# EAGLE design waterius-homemade (EAGLE 9.0.1)
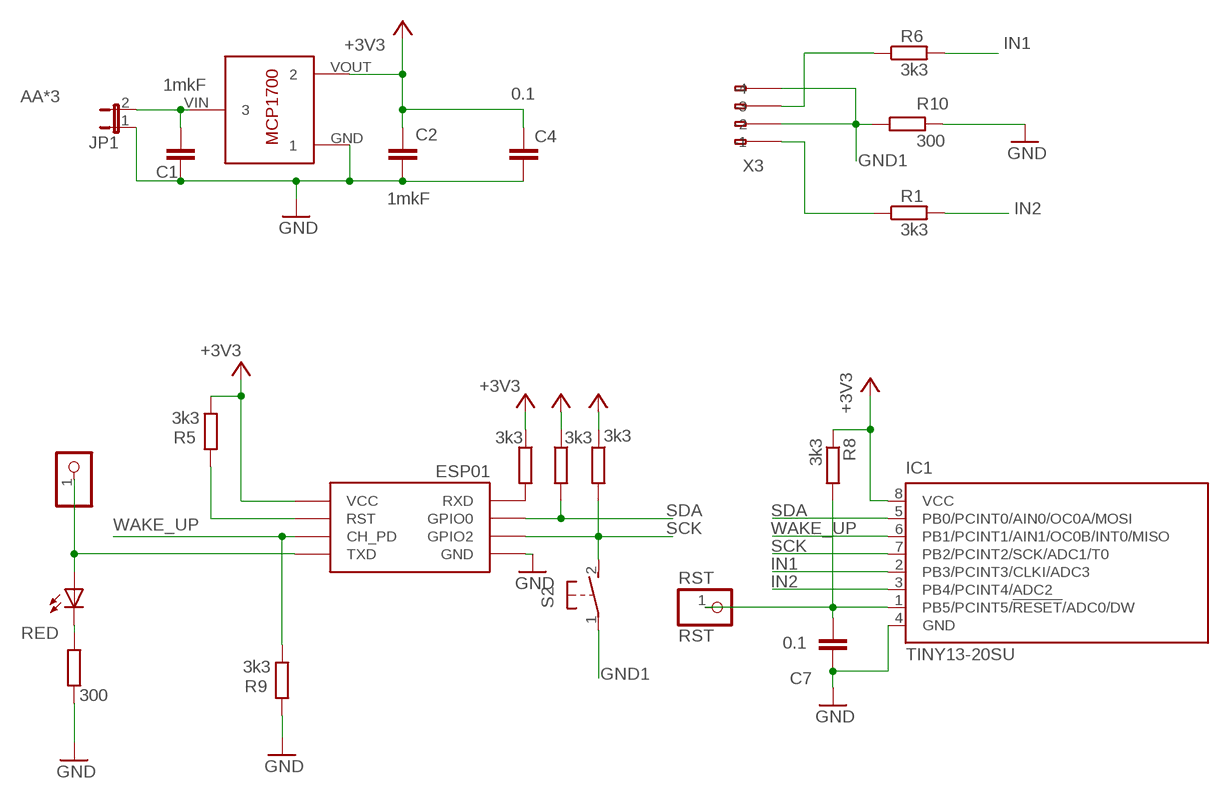
[diagram p0: schematic, sheet 1]

## Parts
C1  1mkF  C-EUC0805  [C0805]
C2  1mkF  C-EUC0805  [C0805]
C4  0.1  C-EUC0805  [C0805]
C7  0.1  C-EUC0805  [C0805]
IC1  TINY13-20SU  [8S2]
JP1  JP1E  [JP1]
LED1  RED  LED3MM  [LED3MM]
LOG  LOG  PINHD-1X1  [1X01]
R1  3k3  R-EU_M0805  [M0805]
R2  3k3  R-EU_R0805  [R0805]
R3  3k3  R-EU_R0805  [R0805]
R4  300  R-EU_R0805  [R0805]
R5  3k3  R-EU_R0805  [R0805]
R6  3k3  R-EU_M0805  [M0805]
R7  3k3  R-EU_R0805  [R0805]
R8  3k3  R-EU_R0805  [R0805]
R9  3k3  R-EU_R0805  [R0805]
R10  300  R-EU_M0805  [M0805]
RST  RST  PINHD-1X1  [1X01]
S2  31-XX  [B3F-31XX]
U$1  ESP01  [ESP01]
U$2  MCP1700T-3302E/TT  [MCP1700T-3302E/TT]
X3  233-104  [233-104]

## Nets
+3V3: C2.1 C4.1 IC1.8(VCC) R2.1 R3.1 R5.1 R7.1 R8.1 U$1.VCC U$2.VOUT
AA*3: C1.1 JP1.2 U$2.VIN
GND: C1.2 C2.2 C4.2 C7.1 IC1.4(GND) JP1.1 R4.2 R9.2 R10.2 U$1.GND U$2.GND
GND1: R10.1 S2.1(P) X3.A2(-2) X3.A4(-4)
IN1: IC1.2(PB3/PCINT3/CLKI/ADC3) R6.2
IN2: IC1.3(PB4/PCINT4/ADC2) R1.2
N$1: LED1.A LOG.1 U$1.TX(TXD)
N$3: R6.1 X3.A3(-3)
N$4: R1.1 X3.A1(-1)
N$6: LED1.K(C) R4.1
N$11: R5.2 U$1.RST
N$13: C7.2 IC1.1(PB5/PCINT5/!RESET!/ADC0/DW) R8.2 RST.1
RX: R7.2 U$1.RX(RXD)
SCK: IC1.7(PB2/PCINT2/SCK/ADC1/T0) R2.2 S2.2(S) U$1.GPIO2
SDA: IC1.5(PB0/PCINT0/AIN0/OC0A/MOSI) R3.2 U$1.GPIO0
WAKE_UP: IC1.6(PB1/PCINT1/AIN1/OC0B/INT0/MISO) R9.1 U$1.CH_PD
Unconnected: X3.B1(B-1) X3.B2(B-2) X3.B3(B-3) X3.B4(B-4)

## Library data of the parts
C1 C2 C7 = resistor:C-EU: CAPACITOR, European symbol
C4 = rcl:C-EU: CAPACITOR, European symbol; SPICEPREFIX: C
IC1 = atmel:TINY13: 8-bit AVR Microcontroller with 1K Bytes In-System Programmable Flash Source: http://www.atmel.com/dyn/resources/prod_documents/2535S.pdf; MPN: ATTINY13-20SU; OC_FARNELL: 9171568; OC_NEWARK: 96K6522
JP1 = jumper:JP1E: JUMPER
LED1 = led:LED: LED OSRAM: - CHIPLED LG R971, LG N971, LY N971, LG Q971, LY Q971, LO R971, LY R971 LH N974, LH R974 LS Q976, LO Q976, LY Q976 LO Q996 - Hyper CHIPLED LW Q18S LB Q993, LB Q99A, LB R99A - SideLED LS A670, LO A670, LY A670, LG A670, LP A670 LB A673, LV A673, LT A673, LW A673 LH A674 LY A675 LS A676, LA A676, LO A676, LY A676, LW A676 LS A679, LY A679, LG A679 - Hyper Micro SIDELED® LS Y876, LA Y876, LO Y876, LY Y876 LT Y87S - SmartLED LW L88C, LW L88S LB L89C, LB L89S, LG L890 LS L89K, LO L89K, LY L89K LS L896, LA L896, LO L896, LY L896 - TOPLED LS T670, LO T670, LY T670, LG T670, LP T670 LSG T670, LSP T670, LSY T670, LOP T670, LYG T670 LG T671, LOG T671, LSG T671 LB T673, LV T673, LT T673, LW T673 LH T674 LS T676, LA T676, LO T676, LY T676, LB T676, LH T676, LSB T676, LW T676 LB T67C, LV T67C, LT T67C, LS T67K, LO T67K, LY T67K, LW E67C LS E67B, LA E67B, LO E67B, LY E67B, LB E67C, LV E67C, LT E67C LW T67C LS T679, LY T679, LG T679 LS T770, LO T770, LY T770, LG T770, LP T770 LB T773, LV T773, LT T773, LW T773 LH T774 LS E675, LA E675, LY E675, LS T675 LS T776, LA T776, LO T776, LY T776, LB T776 LHGB T686 LT T68C, LB T68C - Hyper Mini TOPLED® LB M676 - Mini TOPLED Santana® LG M470 LS M47K, LO M47K, LY M47K Source: http://www.osram.convergy.de LUXEON: - LUMILED® LXK2-PW12-R00, LXK2-PW12-S00, LXK2-PW14-U00, LXK2-PW14-V00 LXK2-PM12-R00, LXK2-PM12-S00, LXK2-PM14-U00 LXK2-PE12-Q00, LXK2-PE12-R00, LXK2-PE12-S00, LXK2-PE14-T00, LXK2-PE14-U00 LXK2-PB12-K00, LXK2-PB12-L00, LXK2-PB12-M00, LXK2-PB14-N00, LXK2-PB14-P00, LXK2-PB14-Q00 LXK2-PR12-L00, LXK2-PR12-M00, LXK2-PR14-Q00, LXK2-PR14-R00 LXK2-PD12-Q00, LXK2-PD12-R00, LXK2-PD12-S00 LXK2-PH12-R00, LXK2-PH12-S00 LXK2-PL12-P00, LXK2-PL12-Q00, LXK2-PL12-R00 Source: www.luxeon.com KINGBRIGHT: KA-3528ASYC Source: www.kingbright.com
LOG RST = pinhead:PINHD-1X1: PIN HEADER
R1 = resistor:R-EU_: RESISTOR, European symbol; SPICEPREFIX: R
R2 R5 R7 R9 = rcl:R-EU_: RESISTOR, European symbol; OM: 3k6
R3 R8 = rcl:R-EU_: RESISTOR, European symbol; OM: 3k6; SPICEPREFIX: R
R4 = rcl:R-EU_: RESISTOR, European symbol; OM: 200; SPICEPREFIX: R
R6 R10 = resistor:R-EU_: RESISTOR, European symbol
S2 = switch-omron:31-XX: OMRON SWITCH; MPN: B3F-3100; OC_FARNELL: 959704; OC_NEWARK: 36M3582
U$1 = esp8266modules:ESP01: ESP8266 Wifi module 01
U$2 = MCP1700T-3302E_TT:MCP1700T-3302E/TT: Microchip LDO "MCP1700" in a 3-Pin SOT-23 package. ID: MCP1700T-3302E/TT
X3 = con-wago255:233-104: WAGO; MPN: 233-104; OC_FARNELL: unknown; OC_NEWARK: 28K9046

## Board
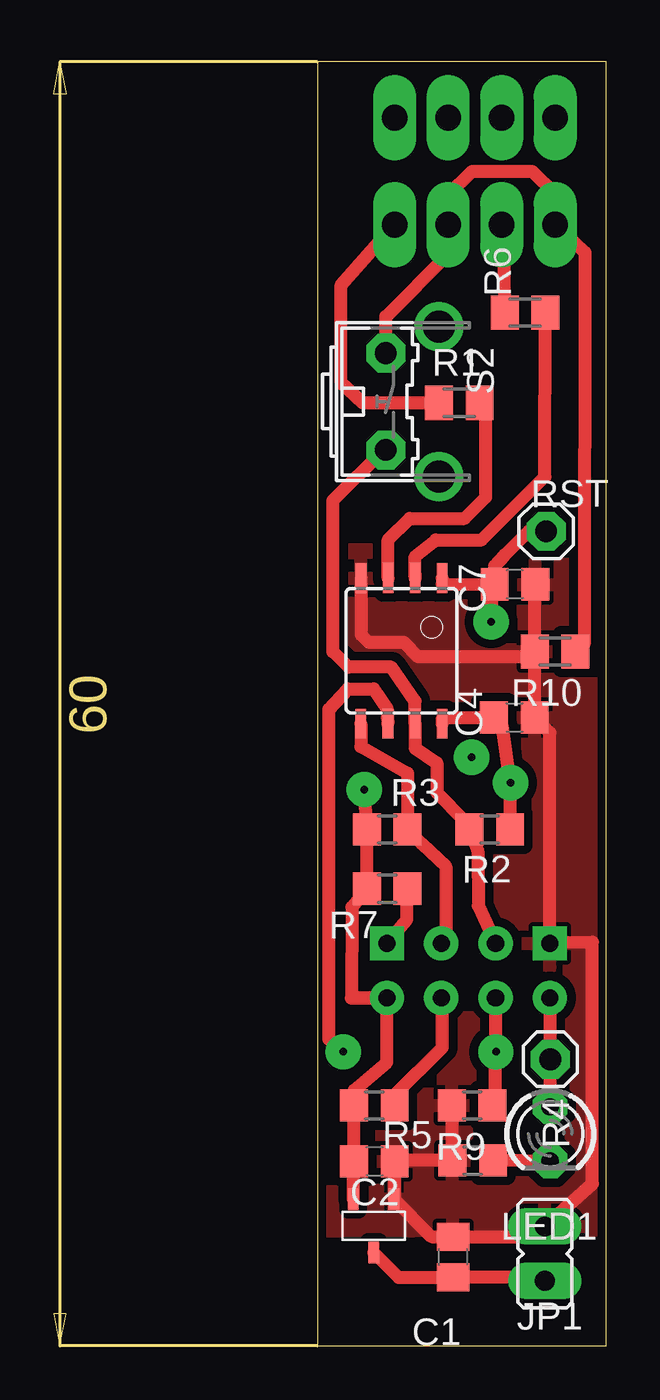
[diagram p1: board, top side]
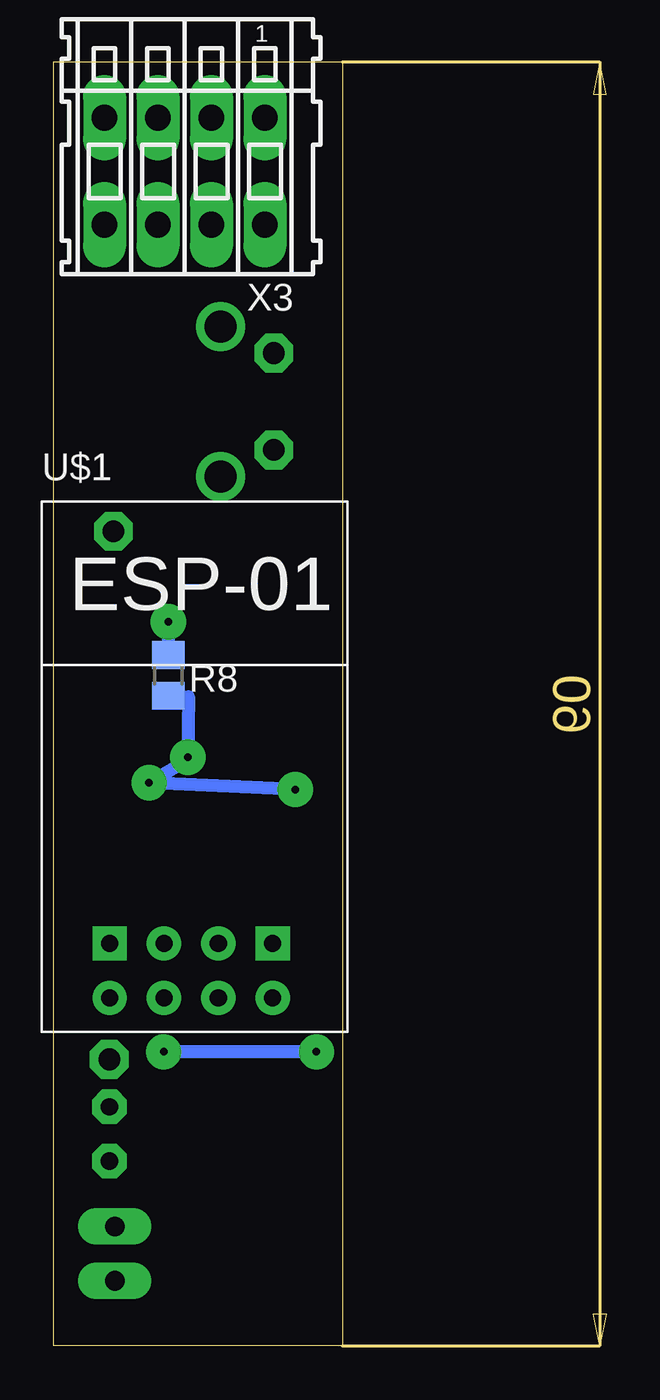
[diagram p2: board, bottom side, seen from below]

Size 13.5 x 60 mm. Coordinates in mm from the lower left corner, seen from the top.
Outline: 0,0 13.5,0 13.5,60 0,60 0,0
Copper layers (1*16): Top 0.035mm / dielectric 1.55mm / Bottom 0.035mm
Design rules "eC_2Layer_PClass6_BaseCopperO35 *": minimum track width 0.15mm, minimum drill 0.35mm, track to track 0.4mm, track to pad 0.5mm, pad to pad 0.5mm, via to via 0.3mm, smd to smd 0mil, copper to edge 0.25mm, drill to drill 0.35mm, minimum pad ring 0.4mm, minimum via ring 0.65mm, stop-mask expansion 0mil, vias tented up to drill 0.45mm, thermal gap 0.2mm

### Footprints (pad centres in the part's own frame; a part is rotated, then mirrored left to right if it is on the bottom)
C0805 = smd 1.3 x 1.5: 1 -0.95,0; 2 0.95,0
8S2 = smd 0.5 x 1.4: 1 -1.905,-3.404; 2 -0.645,-3.404; 3 0.625,-3.404; 4 1.895,-3.404; 5 1.905,3.404; 6 0.635,3.404; 7 -0.635,3.404; 8 -1.905,3.404
JP1 = drill 0.914 long: 1 0,-1.27; 2 0,1.27
LED3MM = drill 0.813 octagon: A -1.27,0; K 1.27,0
1X01 = drill 1.016 octagon: 1 0,0
M0805 = smd 1.3 x 1.6: 1 -0.95,0; 2 0.95,0
R0805 = smd 1.3 x 1.5: 1 -0.95,0; 2 0.95,0
B3F-31XX = drill 1.016 octagon: 1 -2.261,-1.245; 2 2.261,-1.245 | drill 1.499 pad 2.159: 3 -3.505,1.245; 4 3.505,1.245
ESP01 = drill 0.8: CH_PD -1.285,-8.178; GPIO0 1.255,-5.638; GPIO2 -1.285,-5.638; RST 1.255,-8.178; TX -3.825,-8.178; VCC 3.795,-8.178 | drill 0.8 square: GND -3.825,-5.638; RX 3.795,-5.638
MCP1700T-3302E/TT = smd 0.5 x 1: GND -0.95,-1.25; VIN 0,1.25; VOUT 0.95,-1.25
233-104 = drill 1.2 long: A1 -3.75,2.5; A2 -1.25,2.5; A3 1.25,2.5; A4 3.75,2.5; B1 -3.75,-2.5; B2 -1.25,-2.5; B3 1.25,-2.5; B4 3.75,-2.5

### Placement (x,y rotation side)
C1  6.35,4.16 90 top
C2  2.67,8.64 0 top
C4  9.21,29.37 0 top
C7  9.24,35.59 180 top
IC1  3.94,32.48 180 top
JP1  10.64,4.32 180 top
LED1  10.89,9.91 270 top
LOG  10.89,13.4 0 top
R1  6.64,44.07 0 top
R2  8.06,24.13 180 top
R3  3.27,24.13 0 top
R4  7.27,8.67 180 top
R5  2.67,11.24 0 top
R6  9.72,48.29 0 top
R7  3.27,21.37 0 top
R8  8.13,31.34 90 bottom
R9  7.24,11.24 180 top
R10  11.11,32.45 180 top
RST  10.7,38.07 90 top
S2  4.45,44.13 270 top
U$1  7.05,24.45 0 bottom
U$2  2.64,5.62 180 top
X3  7.37,54.9 180 bottom

### Tracks (layer width: path | path; a pad name or v marks a point on that pad's centre or on a via)
+3V3  (via drill 0.35)
  Top 0.61: 1.59,16.26 1.62,20.51 R7.1 R3.1 2.35,24.16 v2.19,26 | 1.59,16.26 3.24,16.26 U$1.VCC | 1.59,16.26 3.27,16.26 3.25,16.02 3.25,13.26 1.72,11.95 R5.1 C2.1 | C2.1 1.69,8.83 | U$2.VOUT 1.69,8.6 C2.1 | IC1.8 5.85,29.36 C4.1 8.65,28.98 v9.03,26.32 9.01,26.31 R2.1
  Bottom 0.61: R8.1 7.19,30.34 v7.22,27.52 7.46,27.25 v9.03,26.32 8.9,26.32 v2.19,26
AA*3
  Top 0.61: U$2.VIN 3.8,3.21 C1.1 10.67,3.21 JP1.2
GND
  Top 0.61: U$1.GND 10.87,18.83 10.86,18.89 12.86,18.86 12.86,7.59 JP1.1 10.16,5.11 C1.2 5.34,5.11 U$2.GND 3.62,6.9 C2.2 3.65,8.67 R4.2 6.29,8.7 R9.2 | IC1.4 2.04,33.24 2.4,32.89 4.04,32.89 4.71,32.22 9.93,32.22 R10.2 | 10.83,18.85 U$1.GND | R10.2 C4.2 10.87,28.65 U$1.GND | R10.2 10.16,35.56 C7.1
  pour Top (isolate 0.406): 13.46,5.43 13.49,37.22 0.06,37.2 0.09,5.36
GND1
  Top 0.61: R10.1 12.48,32.8 12.51,51.1 X3.A4 11.12,53.81 10.03,54.9 7.24,54.9 6.12,53.77 X3.A2 6.12,51.02 3.2,48.11 S2.1
IN1
  Top 0.61: IC1.2 4.57,36.06 4.57,36.89 5.53,37.66 7.68,37.66 10.64,40.62 R6.2
IN2
  Top 0.61: IC1.3 3.31,37.67 4.32,38.67 6.88,38.67 7.87,39.67 7.87,43.78 R1.2
N$1
  Top 0.61: LED1.A LOG.1 10.87,14.13 U$1.TX
N$3
  Top 0.61: R6.1 8.71,51.8 X3.A3
N$4
  Top 0.61: R1.1 2.13,44.07 1.11,45.02 1.11,49.57 X3.A1
N$6
  Top 0.61: LED1.K R4.1
N$11
  Top 0.61: R5.2 3.62,11.71 5.84,13.94 5.84,16.22 U$1.RST
N$13  (via drill 0.35)
  Top 0.61: IC1.1 5.84,35.6 C7.2 | C7.2 8.13,35.75 v8.13,33.85 | C7.2 8.29,36.45 8.77,36.96 9.87,38.07 RST.1
  Bottom 0.61: R8.2 v8.13,33.85
RX
  Top 0.61: U$1.RX 4.19,19.92 R7.2
SCK
  Top 0.61: U$1.GPIO2 8.32,18.82 7.53,20.57 7.5,23.14 R2.2 6.89,24.54 5.59,25.88 5.59,27.24 4.57,27.94 IC1.7 4.57,30.13 3.46,31.72 1.46,31.72 0.73,32.45 0.73,39.5 3.1,41.87 S2.2
SDA
  Top 0.61: IC1.5 2.03,28 4.22,26.77 R3.2 4.89,23.46 6,22.42 6,19.05 5.78,18.82 U$1.GPIO0
WAKE_UP  (via drill 0.35)
  Top 0.61: IC1.6 3.27,29.36 3.27,29.75 2.63,30.7 1.43,30.7 0.54,29.75 0.54,14.35 v1.21,13.75 | U$1.CH_PD 8.33,13.73 | 8.33,13.73 v8.35,13.75 | R9.1 8.33,11.26 8.33,13.73
  Bottom 0.61: v1.21,13.75 v8.35,13.75